# Altium schematic sheet hades_flight_controller_schematic.SchDoc (part 2 of 2)
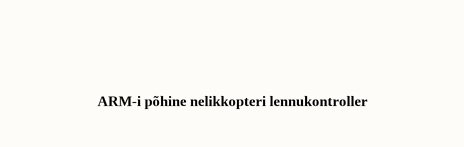
[diagram p4: hades_flight_controller_schematic.SchDoc, bottom right]

## Library data of the parts
C1-C3 C12 C15 = 1uF cap: Multilayer Ceramic Capacitors MLCC - SMD/SMT 0402 1.0uF 6.3volts *Derate Voltage/Temp; Manufacturer: Murata; Manufacturer Part Number: GRM155R70J105KA12D; Tolerance: 10%; Dielectric: X7R; Voltage Rating: 6.3V; Supplier 1: Farnell; Mount: Surface Mount; Case/Package: 0402; Case Code (Metric): 1005; Material: Ceramic; Case Code (Imperial): 0402; Weight: 0.000212oz; Min Operating Temperature: -55°C; Max Operating Temperature: 125°C; Capacitance: 1uF; Packaging: Tape and Reel; Termination: SMD/SMT; Voltage Rating (DC): 6.3V; Package Quantity: 10000; Length: 1mm; Width: 0.5mm; Height: 0.5mm; Thickness: 0.022inch; Depth: 0.5mm; Lead Free: Lead Free; RoHS Compliant: Yes; ComponentLink1URL: http://www.farnell.com/datasheets/2189111.pdf?src-supplier=Newark; ComponentLink1Description: http://www.farnell.com/datasheets/2189111.pdf?src-supplier=Newark; ComponentLink2URL: http://www.farnell.com/datasheets/2189111.pdf?src-supplier=Farnell; ComponentLink2Description: http://www.farnell.com/datasheets/2189111.pdf?src-supplier=Farnell; ComponentLink3URL: https://search.murata.co.jp/Ceramy/image/img/A01X/G101/ENG/GRM155R70J105KA12-01.pdf?src-supplier=Digi-Key; ComponentLink3Description: https://search.murata.co.jp/Ceramy/image/img/A01X/G101/ENG/GRM155R70J105KA12-01.pdf?src-supplier=Digi-Key; ComponentLink4URL: http://www.mouser.com/ds/2/281/c02e-2905.pdf?src-supplier=Mouser; ComponentLink4Description: http://www.mouser.com/ds/2/281/c02e-2905.pdf?src-supplier=Mouser; ComponentLink5URL: http://psearch.en.murata.com/capacitor/product/GRM155R70J105KA12%23.pdf?src-supplier=Avnet; ComponentLink5Description: http://psearch.en.murata.com/capacitor/product/GRM155R70J105KA12%23.pdf?src-supplier=Avnet; ComponentLink6URL: http://components.arrow.com/part/dataview/0323_06434986?src-supplier=Arrow+Europe; ComponentLink6Description: http://components.arrow.com/part/dataview/0323_06434986?src-supplier=Arrow+Europe; Supplier Part Number 1: 2346895
C4 C7-C10 C14 C16-C22 C24 C25 C35 C36 = 0.1uF cap: Cap, 0.1ΜF, 10V, 10%, X7R, 0603, Reel; Manufacturer: Multicomp; Manufacturer Part Number: MC0603B104K100CT; Capacitance: 100nF; Supplier 1: Farnell; Case Code (Metric): 1608; Case Code (Imperial): 0603; Min Operating Temperature: -55°C; Max Operating Temperature: 125°C; Voltage Rating: 10V; Dielectric: X7R; Packaging: Cut Tape; Tolerance: 10%; Voltage Rating (DC): 10V; REACH SVHC: No SVHC; ComponentLink1URL: http://www.farnell.com/datasheets/2117900.pdf?src-supplier=Element14; ComponentLink1Description: http://www.farnell.com/datasheets/2117900.pdf?src-supplier=Element14; ComponentLink2URL: http://www.farnell.com/datasheets/2117933.pdf?src-supplier=Farnell; ComponentLink2Description: http://www.farnell.com/datasheets/2117933.pdf?src-supplier=Farnell; ComponentLink3URL: http://www.farnell.com/datasheets/2117933.pdf?src-supplier=Element14; ComponentLink3Description: http://www.farnell.com/datasheets/2117933.pdf?src-supplier=Element14; Supplier Part Number 1: 1856307
C5 C6 = 22pF cap: 0402 22 pF 50 V ±5 % Tolerance C0G SMT Multilayer Ceramic Capacitor; Manufacturer: Murata; Manufacturer Part Number: GCM1555C1H220JA16D; Tolerance: 5%; Voltage Rating: 50V; Supplier 1: Farnell; Mount: Surface Mount; Case/Package: 0402; Case Code (Metric): 1005; Case Code (Imperial): 0402; Weight: 0.000212oz; Min Operating Temperature: -55°C; Max Operating Temperature: 125°C; Package Quantity: 1; Packaging: Tape and Reel; Capacitance: 22pF; Dielectric: C0G; Termination: SMD/SMT; Voltage Rating (DC): 50V; Length: 1mm; Width: 0.5mm; Height: 0.5mm; Thickness: 0.022inch; Depth: 0.5mm; Ratings: AEC-Q200; Lead Free: Lead Free; RoHS Compliant: Yes; ComponentLink1URL: http://www.farnell.com/datasheets/2189077.pdf?src-supplier=Farnell; ComponentLink1Description: http://www.farnell.com/datasheets/2189077.pdf?src-supplier=Farnell; ComponentLink2URL: http://www.farnell.com/datasheets/2189077.pdf?src-supplier=Element14; ComponentLink2Description: http://www.farnell.com/datasheets/2189077.pdf?src-supplier=Element14; ComponentLink3URL: http://search.murata.co.jp/Ceramy/image/img/A01X/partnumbering_e_02.pdf?src-supplier=Digi-Key; ComponentLink3Description: http://search.murata.co.jp/Ceramy/image/img/A01X/partnumbering_e_02.pdf?src-supplier=Digi-Key; ComponentLink4URL: http://www.mouser.com/ds/2/281/c03e-806517.pdf?src-supplier=Mouser; ComponentLink4Description: http://www.mouser.com/ds/2/281/c03e-806517.pdf?src-supplier=Mouser; ComponentLink5URL: http://psearch.en.murata.com/capacitor/product/GCM1555C1H220JA16%23.pdf?src-supplier=Avnet; ComponentLink5Description: http://psearch.en.murata.com/capacitor/product/GCM1555C1H220JA16%23.pdf?src-supplier=Avnet; ComponentLink6URL: http://components.arrow.com/part/dataview/0323_07199610?src-supplier=Arrow+Europe; ComponentLink6Description: http://components.arrow.com/part/dataview/0323_07199610?src-supplier=Arrow+Europe; Supplier Part Number 1: 2781410
C23 = 4.7uF cap: 0805 4.7 uF 50 V ±10% Tolerance X5R SMT Multilayer Ceramic Chip Capacitor; Manufacturer: Murata; Manufacturer Part Number: GRT21BR61H475KE13L; Voltage Rating: 50V; Supplier 1: Farnell; Stock 1: 51693; Mount: Surface Mount; Case/Package: 0805; Case Code (Metric): 2012; Case Code (Imperial): 0805; Min Operating Temperature: -55°C; Max Operating Temperature: 85°C; Packaging: Tape and Reel; Capacitance: 4.7uF; Tolerance: 10%; Dielectric: X5R; Voltage Rating (DC): 50V; Length: 0.079inch; Width: 0.049inch; Thickness: 0.057inch; Ratings: AEC-Q200; RoHS Compliant: Yes; ComponentLink1URL: http://www.farnell.com/datasheets/2165993.pdf?src-supplier=Farnell; ComponentLink1Description: http://www.farnell.com/datasheets/2165993.pdf?src-supplier=Farnell; ComponentLink2URL: http://www.farnell.com/datasheets/2165993.pdf?src-supplier=Element14; ComponentLink2Description: http://www.farnell.com/datasheets/2165993.pdf?src-supplier=Element14; ComponentLink3URL: http://search.murata.co.jp/Ceramy/image/img/A01X/G101/ENG/GRT21BR61H475KE13-01.pdf?src-supplier=Digi-Key; ComponentLink3Description: http://search.murata.co.jp/Ceramy/image/img/A01X/G101/ENG/GRT21BR61H475KE13-01.pdf?src-supplier=Digi-Key; Supplier Part Number 1: 2672194; Pricing 1: 5=0.38, 50=0.194, 250=0.174, 500=0.154, 1500=0.128, 3000=0.1, 15000=0.098 (EUR)
D1 = KP-1608QBC-D: LED Uni-Color Blue 468nm 2-Pin Chip LED T/R; Manufacturer: Kingbright; Lens Color: Clear; Viewing Angle: 120°; Lens Style: Diffused,Colorless,Circular,Rectangular; Number of LEDs: 1; Wavelength: 465nm; Luminous Intensity: 100mcd; Forward Voltage: 3.3V; Dominant Wavelength: 470nm; Forward Current: 20mA; Supplier 1: Farnell; Manufacturer Part Number: KP-1608QBC-D; Stock 1: 2000; Pricing 1: 2000=0.1 (EUR); Mount: Surface Mount; Case/Package: 1608; Number of Pins: 2; Color: Blue; Packaging: Tape and Reel; Series: KP; Length: 0.8mm; Width: 1.6mm; Height: 1.1mm; Radiation Hardening: No; REACH SVHC: No SVHC; RoHS Compliant: No; ComponentLink1URL: http://www.farnell.com/datasheets/2045913.pdf?src-supplier=Element14; ComponentLink1Description: http://www.farnell.com/datasheets/2045913.pdf?src-supplier=Element14; ComponentLink2URL: http://www.produktinfo.conrad.com/datenblaetter/1000000-1099999/001050379-da-01-en-SMD_CHIPLED_BL_0603_KP_1608QBC_D.pdf?src-supplier=Conrad; ComponentLink2Description: http://www.produktinfo.conrad.com/datenblaetter/1000000-1099999/001050379-da-01-en-SMD_CHIPLED_BL_0603_KP_1608QBC_D.pdf?src-supplier=Conrad; Supplier Part Number 1: 2449779
DS1 = MDOB048064AV-WI: Oled Graphic Display, Cob, 48 X 64PIXELS; Manufacturer: Midas; Supplier 1: Farnell; Manufacturer Part Number: MDOB048064AV-WI; Stock 1: 48; Supplier Part Number 1: 3154938; Pricing 1: 1=6.97, 5=6.06, 10=5.81, 50=4.98 (EUR)
G1 = LFXTAL055901: Crystal, 8MHZ, 18PF, 5MM X 3.2MM; Manufacturer: IQD; Supplier 1: Farnell; Manufacturer Part Number: LFXTAL055901; Stock 1: 2188; Pricing 1: 1=0.729, 50=0.517, 100=0.457, 250=0.43, 500=0.404, 1000=0.377, 5000=0.35 (EUR); Supplier Part Number 1: 2832062
J1-J4 = 292253-3 (motor): Headers & Wire Housings 3P R/A HDR ASSY; Manufacturer: TE Connectivity; Shape: Rectangular; Number of Positions: 3; Connector Type: Header,Pin; Wire/Cable Type: Discrete; Backwall/Post Interruptions: No (Without); Connector System: Wire-to-Board; Mating Alignment: Yes (With); PCB Mount Retention: With; PCB Mounting Orientation: Right Angle; Contact Current Rating: 4A; Contact Resistance: 20mR; Max Voltage Rating (AC): 125V; Current Rating: 2A; Gender: Male; Pitch: 2mm; PCB Thickness: 0.8mm; Tail Length: 3.2mm; Wire/Cable Gauge: 22AWG; Approvals: UL; Supplier 1: Farnell; Manufacturer Part Number: 292253-3; Mount: Through Hole; Contact Material: Brass; Contact Plating: Tin; Housing Color: Natural; Housing Material: Nylon; Color: Natural; Contact Shape: Round; Material: Nylon; Min Operating Temperature: -40°C; Max Operating Temperature: 105°C; Number of Rows: 1; Termination: Solder; Packaging: Bag; Package Quantity: 500; Number of Contacts: 3; Contact Retention: No (Without); Mating Retention: No (Without); PCB Mount Alignment: No (Without); Sealable: No (Without); Orientation: Right Angle; Series: AMP CT; Contact Type: Male Pin; Voltage Rating: 125V; Max Voltage Rating (DC): 125V; Contact Gender: Male; Length: 7.8mm; Width: 0.157inch; Height: 8.8mm; Contact Mating Length: 0.177inch; Depth: 8.8mm; Radiation Hardening: No; Flammability Rating: UL94 V-0; RoHS Compliant: Yes; ELV: Compliant; Lead Free: Lead Free; REACH SVHC: No SVHC; ComponentLink1URL: http://www.farnell.com/datasheets/1828722.pdf?src-supplier=Farnell; ComponentLink1Description: http://www.farnell.com/datasheets/1828722.pdf?src-supplier=Farnell; ComponentLink2URL: http://www.te.com/commerce/DocumentDelivery/DDEController?Action=showdoc&DocId=Data+Sheet%7F1-1773455-8_CT_CONNECTOR_SERIES_QRG%7F0909%7Fpdf%7FEnglish%7FENG_DS_1-1773455-8_CT_CONNECTOR_SERIES_QRG_0909.pdf&src-supplier=Avnet+Europe; ComponentLink2Description: http://www.te.com/commerce/DocumentDelivery/DDEController?Action=showdoc&DocId=Data+Sheet%7F1-1773455-8_CT_CONNECTOR_SERIES_QRG%7F0909%7Fpdf%7FEnglish%7FENG_DS_1-1773455-8_CT_CONNECTOR_SERIES_QRG_0909.pdf&src-supplier=Avnet+Europe; ComponentLink3URL: http://www.te.com/commerce/DocumentDelivery/DDEController?Action=showdoc&DocId=Data+Sheet%7F1-1773455-8_CT_CONNECTOR_SERIES_QRG%7F0909%7Fpdf%7FEnglish%7FENG_DS_1-1773455-8_CT_CONNECTOR_SERIES_QRG_0909.pdf&src-supplier=Avnet+Asia; ComponentLink3Description: http://www.te.com/commerce/DocumentDelivery/DDEController?Action=showdoc&DocId=Data+Sheet%7F1-1773455-8_CT_CONNECTOR_SERIES_QRG%7F0909%7Fpdf%7FEnglish%7FENG_DS_1-1773455-8_CT_CONNECTOR_SERIES_QRG_0909.pdf&src-supplier=Avnet+Asia; ComponentLink4URL: http://www.onlinecomponents.com/productFiles/mf-AMP/basics292253-3_0.pdf?src-supplier=Onlinecomponents.com; ComponentLink4Description: http://www.onlinecomponents.com/productFiles/mf-AMP/basics292253-3_0.pdf?src-supplier=Onlinecomponents.com; ComponentLink5URL: https://www.alliedelec.com/m/d/b828f7336fbcfaaba46c8aec8fa2474c.pdf?src-supplier=Allied+Electronics; ComponentLink5Description: https://www.alliedelec.com/m/d/b828f7336fbcfaaba46c8aec8fa2474c.pdf?src-supplier=Allied+Electronics; ComponentLink6URL: https://www.te.com/commerce/DocumentDelivery/DDEController?Action=srchrtrv&DocNm=292253&DocType=Customer+Drawing&DocLang=English&src-supplier=Digi-Key; ComponentLink6Description: https://www.te.com/commerce/DocumentDelivery/DDEController?Action=srchrtrv&DocNm=292253&DocType=Customer+Drawing&DocLang=English&src-supplier=Digi-Key; Supplier Part Number 1: 1675774
J5 = 292161-4 (balance): CONN HEADER 4POS VERT 2MM T/H; Manufacturer: TE Connectivity; Shape: Rectangular; Body Material: Nylon; Body Plating: Tin; Number of Positions: 4; Connector Type: Header,Pin; Mating Retention: No (Without); PCB Mount Retention: With; PCB Mounting Orientation: Vertical; Contact Resistance: 20mR; Max Voltage Rating (AC): 125V; Wire/Cable Type: Discrete; Connector System: Wire-to-Board; Contact Retention: Yes (With); Contact Current Rating: 4A; Contact Style: Straight; Gender: Male; Wire/Cable Gauge: 22AWG; Plating Thickness: 2um; Tail Length: 3.2mm; PCB Thickness: 0.8mm; Approvals: UL; Supplier 1: Farnell; Manufacturer Part Number: 292161-4; Stock 1: 3420; Pricing 1: 10=0.346, 100=0.282, 500=0.256, 1000=0.211, 2500=0.192, 5000=0.185 (EUR); Mount: Through Hole; Contact Plating: Tin; Contact Material: Brass; Housing Color: Natural; Housing Material: Nylon; Contact Shape: Round; Color: Natural; Material: Nylon; Min Operating Temperature: -40°C; Max Operating Temperature: 105°C; Number of Rows: 1; Packaging: Bag; Termination: Solder; Number of Contacts: 4; Package Quantity: 1000; Orientation: Straight; PCB Mount Alignment: No (Without); Sealable: No (Without); Series: AMP CT; Backwall/Post Interruptions: No (Without); Mating Alignment: No (Without); Strain Relief: No (Without); Voltage Rating: 125V; Contact Type: Male Pin; Current Rating: 4A; Contact Gender: Male; Voltage Rating (DC): 125V; Max Voltage Rating (DC): 125V; Voltage Rating (AC): 125V; Length: 9.8mm; Width: 3.6mm; Height: 0.267inch; Pitch: 2mm; Contact Mating Length: 0.177inch; Depth: 3.6mm; Lead Pitch: 2mm; Radiation Hardening: No; Flammability Rating: UL94 V-0; RoHS Compliant: Yes; ELV: Compliant; REACH SVHC: No SVHC; Lead Free: Lead Free; ComponentLink1URL: http://www.farnell.com/datasheets/1631402.pdf?src-supplier=Element14; ComponentLink1Description: http://www.farnell.com/datasheets/1631402.pdf?src-supplier=Element14; ComponentLink2URL: https://www.distrelec.biz/Web/Downloads/_t/ds/292161_x_eng_tds.pdf?mime=application%2Fpdf&src-supplier=Distrelec; ComponentLink2Description: https://www.distrelec.biz/Web/Downloads/_t/ds/292161_x_eng_tds.pdf?mime=application%2Fpdf&src-supplier=Distrelec; ComponentLink3URL: http://www.jameco.com/Jameco/Products/ProdDS/1931034.pdf?src-supplier=Jameco; ComponentLink3Description: http://www.jameco.com/Jameco/Products/ProdDS/1931034.pdf?src-supplier=Jameco; ComponentLink4URL: http://www.te.com/commerce/DocumentDelivery/DDEController?Action=showdoc&DocId=Data+Sheet%7F1-1773455-8_CT_CONNECTOR_SERIES_QRG%7F0909%7Fpdf%7FEnglish%7FENG_DS_1-1773455-8_CT_CONNECTOR_SERIES_QRG_0909.pdf&src-supplier=Avnet; ComponentLink4Description: http://www.te.com/commerce/DocumentDelivery/DDEController?Action=showdoc&DocId=Data+Sheet%7F1-1773455-8_CT_CONNECTOR_SERIES_QRG%7F0909%7Fpdf%7FEnglish%7FENG_DS_1-1773455-8_CT_CONNECTOR_SERIES_QRG_0909.pdf&src-supplier=Avnet; ComponentLink5URL: http://www.te.com/commerce/DocumentDelivery/DDEController?Action=showdoc&DocId=Customer+Drawing%7F292161%7FP%7Fpdf%7FEnglish%7FENG_CD_292161_P.pdf%7F292161-4&src-supplier=Future+Electronics; ComponentLink5Description: http://www.te.com/commerce/DocumentDelivery/DDEController?Action=showdoc&DocId=Customer+Drawing%7F292161%7FP%7Fpdf%7FEnglish%7FENG_CD_292161_P.pdf%7F292161-4&src-supplier=Future+Electronics; ComponentLink6URL: http://www.te.com/commerce/DocumentDelivery/DDEController?Action=showdoc&DocId=Data+Sheet%7F1-1773455-8_CT_CONNECTOR_SERIES_QRG%7F0909%7Fpdf%7FEnglish%7FENG_DS_1-1773455-8_CT_CONNECTOR_SERIES_QRG_0909.pdf&src-supplier=Avnet+Europe; ComponentLink6Description: http://www.te.com/commerce/DocumentDelivery/DDEController?Action=showdoc&DocId=Data+Sheet%7F1-1773455-8_CT_CONNECTOR_SERIES_QRG%7F0909%7Fpdf%7FEnglish%7FENG_DS_1-1773455-8_CT_CONNECTOR_SERIES_QRG_0909.pdf&src-supplier=Avnet+Europe; ComponentLink7URL: http://www.te.com/commerce/DocumentDelivery/DDEController?Action=srchrtrv&DocNm=292161&DocType=Customer+Drawing&DocLang=English&src-supplier=Digi-Key; ComponentLink7Description: http://www.te.com/commerce/DocumentDelivery/DDEController?Action=srchrtrv&DocNm=292161&DocType=Customer+Drawing&DocLang=English&src-supplier=Digi-Key; Supplier Part Number 1: 1282952
J6-J11 = 292253-3 (RC): Post Header Assembly, 3 Position, Horizontal, 2mm Pitch, DIP Standard Type; Manufacturer: TE Connectivity; Shape: Rectangular; Number of Positions: 3; Connector Type: Header,Pin; Wire/Cable Type: Discrete; Backwall/Post Interruptions: No (Without); Connector System: Wire-to-Board; Mating Alignment: Yes (With); PCB Mount Retention: With; PCB Mounting Orientation: Right Angle; Contact Current Rating: 4A; Contact Resistance: 20mR; Max Voltage Rating (AC): 125V; Current Rating: 2A; Gender: Male; PCB Thickness: 0.8mm; Tail Length: 3.2mm; Wire/Cable Gauge: 22AWG; Approvals: UL; Supplier 1: Farnell; Manufacturer Part Number: 292253-3; Mount: Through Hole; Contact Material: Brass; Contact Plating: Tin; Housing Color: Natural; Housing Material: Nylon; Color: Natural; Contact Shape: Round; Material: Nylon; Min Operating Temperature: -40°C; Max Operating Temperature: 105°C; Number of Rows: 1; Termination: Solder; Packaging: Bag; Package Quantity: 500; Number of Contacts: 3; Contact Retention: No (Without); Mating Retention: No (Without); PCB Mount Alignment: No (Without); Sealable: No (Without); Orientation: Right Angle; Series: AMP CT; Contact Type: Male Pin; Voltage Rating: 125V; Max Voltage Rating (DC): 125V; Contact Gender: Male; Length: 7.8mm; Width: 0.157inch; Height: 8.8mm; Pitch: 2mm; Contact Mating Length: 0.177inch; Depth: 8.8mm; Radiation Hardening: No; Flammability Rating: UL94 V-0; RoHS Compliant: Yes; ELV: Compliant; Lead Free: Lead Free; REACH SVHC: No SVHC; ComponentLink1URL: http://www.farnell.com/datasheets/1828722.pdf?src-supplier=Farnell; ComponentLink1Description: http://www.farnell.com/datasheets/1828722.pdf?src-supplier=Farnell; ComponentLink2URL: http://www.te.com/commerce/DocumentDelivery/DDEController?Action=showdoc&DocId=Data+Sheet%7F1-1773455-8_CT_CONNECTOR_SERIES_QRG%7F0909%7Fpdf%7FEnglish%7FENG_DS_1-1773455-8_CT_CONNECTOR_SERIES_QRG_0909.pdf&src-supplier=Avnet+Europe; ComponentLink2Description: http://www.te.com/commerce/DocumentDelivery/DDEController?Action=showdoc&DocId=Data+Sheet%7F1-1773455-8_CT_CONNECTOR_SERIES_QRG%7F0909%7Fpdf%7FEnglish%7FENG_DS_1-1773455-8_CT_CONNECTOR_SERIES_QRG_0909.pdf&src-supplier=Avnet+Europe; ComponentLink3URL: http://www.te.com/commerce/DocumentDelivery/DDEController?Action=showdoc&DocId=Data+Sheet%7F1-1773455-8_CT_CONNECTOR_SERIES_QRG%7F0909%7Fpdf%7FEnglish%7FENG_DS_1-1773455-8_CT_CONNECTOR_SERIES_QRG_0909.pdf&src-supplier=Avnet+Asia; ComponentLink3Description: http://www.te.com/commerce/DocumentDelivery/DDEController?Action=showdoc&DocId=Data+Sheet%7F1-1773455-8_CT_CONNECTOR_SERIES_QRG%7F0909%7Fpdf%7FEnglish%7FENG_DS_1-1773455-8_CT_CONNECTOR_SERIES_QRG_0909.pdf&src-supplier=Avnet+Asia; ComponentLink4URL: http://www.onlinecomponents.com/productFiles/mf-AMP/basics292253-3_0.pdf?src-supplier=Onlinecomponents.com; ComponentLink4Description: http://www.onlinecomponents.com/productFiles/mf-AMP/basics292253-3_0.pdf?src-supplier=Onlinecomponents.com; ComponentLink5URL: https://www.alliedelec.com/m/d/b828f7336fbcfaaba46c8aec8fa2474c.pdf?src-supplier=Allied+Electronics; ComponentLink5Description: https://www.alliedelec.com/m/d/b828f7336fbcfaaba46c8aec8fa2474c.pdf?src-supplier=Allied+Electronics; ComponentLink6URL: https://www.te.com/commerce/DocumentDelivery/DDEController?Action=srchrtrv&DocNm=292253&DocType=Customer+Drawing&DocLang=English&src-supplier=Digi-Key; ComponentLink6Description: https://www.te.com/commerce/DocumentDelivery/DDEController?Action=srchrtrv&DocNm=292253&DocType=Customer+Drawing&DocLang=English&src-supplier=Digi-Key; Supplier Part Number 1: 1675774
J12 = 292161-4 (led driver): CONN HEADER 4POS VERT 2MM T/H; Manufacturer: TE Connectivity; Shape: Rectangular; Body Material: Nylon; Body Plating: Tin; Number of Positions: 4; Connector Type: Header,Pin; Mating Retention: No (Without); PCB Mount Retention: With; PCB Mounting Orientation: Vertical; Contact Resistance: 20mR; Max Voltage Rating (AC): 125V; Wire/Cable Type: Discrete; Connector System: Wire-to-Board; Contact Retention: Yes (With); Contact Current Rating: 4A; Contact Style: Straight; Gender: Male; Wire/Cable Gauge: 22AWG; Plating Thickness: 2um; Tail Length: 3.2mm; PCB Thickness: 0.8mm; Approvals: UL; Supplier 1: Farnell; Manufacturer Part Number: 292161-4; Stock 1: 3420; Pricing 1: 10=0.346, 100=0.282, 500=0.256, 1000=0.211, 2500=0.192, 5000=0.185 (EUR); Mount: Through Hole; Contact Plating: Tin; Contact Material: Brass; Housing Color: Natural; Housing Material: Nylon; Contact Shape: Round; Color: Natural; Material: Nylon; Min Operating Temperature: -40°C; Max Operating Temperature: 105°C; Number of Rows: 1; Packaging: Bag; Termination: Solder; Number of Contacts: 4; Package Quantity: 1000; Orientation: Straight; PCB Mount Alignment: No (Without); Sealable: No (Without); Series: AMP CT; Backwall/Post Interruptions: No (Without); Mating Alignment: No (Without); Strain Relief: No (Without); Voltage Rating: 125V; Contact Type: Male Pin; Current Rating: 4A; Contact Gender: Male; Voltage Rating (DC): 125V; Max Voltage Rating (DC): 125V; Voltage Rating (AC): 125V; Length: 9.8mm; Width: 3.6mm; Height: 0.267inch; Pitch: 2mm; Contact Mating Length: 0.177inch; Depth: 3.6mm; Lead Pitch: 2mm; Radiation Hardening: No; Flammability Rating: UL94 V-0; RoHS Compliant: Yes; ELV: Compliant; REACH SVHC: No SVHC; Lead Free: Lead Free; ComponentLink1URL: http://www.farnell.com/datasheets/1631402.pdf?src-supplier=Element14; ComponentLink1Description: http://www.farnell.com/datasheets/1631402.pdf?src-supplier=Element14; ComponentLink2URL: https://www.distrelec.biz/Web/Downloads/_t/ds/292161_x_eng_tds.pdf?mime=application%2Fpdf&src-supplier=Distrelec; ComponentLink2Description: https://www.distrelec.biz/Web/Downloads/_t/ds/292161_x_eng_tds.pdf?mime=application%2Fpdf&src-supplier=Distrelec; ComponentLink3URL: http://www.jameco.com/Jameco/Products/ProdDS/1931034.pdf?src-supplier=Jameco; ComponentLink3Description: http://www.jameco.com/Jameco/Products/ProdDS/1931034.pdf?src-supplier=Jameco; ComponentLink4URL: http://www.te.com/commerce/DocumentDelivery/DDEController?Action=showdoc&DocId=Data+Sheet%7F1-1773455-8_CT_CONNECTOR_SERIES_QRG%7F0909%7Fpdf%7FEnglish%7FENG_DS_1-1773455-8_CT_CONNECTOR_SERIES_QRG_0909.pdf&src-supplier=Avnet; ComponentLink4Description: http://www.te.com/commerce/DocumentDelivery/DDEController?Action=showdoc&DocId=Data+Sheet%7F1-1773455-8_CT_CONNECTOR_SERIES_QRG%7F0909%7Fpdf%7FEnglish%7FENG_DS_1-1773455-8_CT_CONNECTOR_SERIES_QRG_0909.pdf&src-supplier=Avnet; ComponentLink5URL: http://www.te.com/commerce/DocumentDelivery/DDEController?Action=showdoc&DocId=Customer+Drawing%7F292161%7FP%7Fpdf%7FEnglish%7FENG_CD_292161_P.pdf%7F292161-4&src-supplier=Future+Electronics; ComponentLink5Description: http://www.te.com/commerce/DocumentDelivery/DDEController?Action=showdoc&DocId=Customer+Drawing%7F292161%7FP%7Fpdf%7FEnglish%7FENG_CD_292161_P.pdf%7F292161-4&src-supplier=Future+Electronics; ComponentLink6URL: http://www.te.com/commerce/DocumentDelivery/DDEController?Action=showdoc&DocId=Data+Sheet%7F1-1773455-8_CT_CONNECTOR_SERIES_QRG%7F0909%7Fpdf%7FEnglish%7FENG_DS_1-1773455-8_CT_CONNECTOR_SERIES_QRG_0909.pdf&src-supplier=Avnet+Europe; ComponentLink6Description: http://www.te.com/commerce/DocumentDelivery/DDEController?Action=showdoc&DocId=Data+Sheet%7F1-1773455-8_CT_CONNECTOR_SERIES_QRG%7F0909%7Fpdf%7FEnglish%7FENG_DS_1-1773455-8_CT_CONNECTOR_SERIES_QRG_0909.pdf&src-supplier=Avnet+Europe; ComponentLink7URL: http://www.te.com/commerce/DocumentDelivery/DDEController?Action=srchrtrv&DocNm=292161&DocType=Customer+Drawing&DocLang=English&src-supplier=Digi-Key; ComponentLink7Description: http://www.te.com/commerce/DocumentDelivery/DDEController?Action=srchrtrv&DocNm=292161&DocType=Customer+Drawing&DocLang=English&src-supplier=Digi-Key; Supplier Part Number 1: 1282952
J13 = 292161-4: CONN HEADER 4POS VERT 2MM T/H; Manufacturer: TE Connectivity; Shape: Rectangular; Body Material: Nylon; Body Plating: Tin; Number of Positions: 4; Connector Type: Header,Pin; Mating Retention: No (Without); PCB Mount Retention: With; PCB Mounting Orientation: Vertical; Contact Resistance: 20mR; Max Voltage Rating (AC): 125V; Wire/Cable Type: Discrete; Connector System: Wire-to-Board; Contact Retention: Yes (With); Contact Current Rating: 4A; Contact Style: Straight; Gender: Male; Wire/Cable Gauge: 22AWG; Plating Thickness: 2um; Tail Length: 3.2mm; PCB Thickness: 0.8mm; Approvals: UL; Supplier 1: Farnell; Manufacturer Part Number: 292161-4; Mount: Through Hole; Contact Plating: Tin; Contact Material: Brass; Housing Color: Natural; Housing Material: Nylon; Contact Shape: Round; Color: Natural; Material: Nylon; Min Operating Temperature: -40°C; Max Operating Temperature: 105°C; Number of Rows: 1; Packaging: Bag; Termination: Solder; Number of Contacts: 4; Package Quantity: 1000; Orientation: Straight; PCB Mount Alignment: No (Without); Sealable: No (Without); Series: AMP CT; Backwall/Post Interruptions: No (Without); Mating Alignment: No (Without); Strain Relief: No (Without); Voltage Rating: 125V; Contact Type: Male Pin; Current Rating: 4A; Contact Gender: Male; Voltage Rating (DC): 125V; Max Voltage Rating (DC): 125V; Voltage Rating (AC): 125V; Length: 9.8mm; Width: 3.6mm; Height: 0.267inch; Pitch: 2mm; Contact Mating Length: 0.177inch; Depth: 3.6mm; Lead Pitch: 2mm; Radiation Hardening: No; Flammability Rating: UL94 V-0; RoHS Compliant: Yes; ELV: Compliant; REACH SVHC: No SVHC; Lead Free: Lead Free; ComponentLink1URL: http://www.farnell.com/datasheets/1631402.pdf?src-supplier=Element14; ComponentLink1Description: http://www.farnell.com/datasheets/1631402.pdf?src-supplier=Element14; ComponentLink2URL: https://www.distrelec.biz/Web/Downloads/_t/ds/292161_x_eng_tds.pdf?mime=application%2Fpdf&src-supplier=Distrelec; ComponentLink2Description: https://www.distrelec.biz/Web/Downloads/_t/ds/292161_x_eng_tds.pdf?mime=application%2Fpdf&src-supplier=Distrelec; ComponentLink3URL: http://www.jameco.com/Jameco/Products/ProdDS/1931034.pdf?src-supplier=Jameco; ComponentLink3Description: http://www.jameco.com/Jameco/Products/ProdDS/1931034.pdf?src-supplier=Jameco; ComponentLink4URL: http://www.te.com/commerce/DocumentDelivery/DDEController?Action=showdoc&DocId=Data+Sheet%7F1-1773455-8_CT_CONNECTOR_SERIES_QRG%7F0909%7Fpdf%7FEnglish%7FENG_DS_1-1773455-8_CT_CONNECTOR_SERIES_QRG_0909.pdf&src-supplier=Avnet; ComponentLink4Description: http://www.te.com/commerce/DocumentDelivery/DDEController?Action=showdoc&DocId=Data+Sheet%7F1-1773455-8_CT_CONNECTOR_SERIES_QRG%7F0909%7Fpdf%7FEnglish%7FENG_DS_1-1773455-8_CT_CONNECTOR_SERIES_QRG_0909.pdf&src-supplier=Avnet; ComponentLink5URL: http://www.te.com/commerce/DocumentDelivery/DDEController?Action=showdoc&DocId=Customer+Drawing%7F292161%7FP%7Fpdf%7FEnglish%7FENG_CD_292161_P.pdf%7F292161-4&src-supplier=Future+Electronics; ComponentLink5Description: http://www.te.com/commerce/DocumentDelivery/DDEController?Action=showdoc&DocId=Customer+Drawing%7F292161%7FP%7Fpdf%7FEnglish%7FENG_CD_292161_P.pdf%7F292161-4&src-supplier=Future+Electronics; ComponentLink6URL: http://www.te.com/commerce/DocumentDelivery/DDEController?Action=showdoc&DocId=Data+Sheet%7F1-1773455-8_CT_CONNECTOR_SERIES_QRG%7F0909%7Fpdf%7FEnglish%7FENG_DS_1-1773455-8_CT_CONNECTOR_SERIES_QRG_0909.pdf&src-supplier=Avnet+Europe; ComponentLink6Description: http://www.te.com/commerce/DocumentDelivery/DDEController?Action=showdoc&DocId=Data+Sheet%7F1-1773455-8_CT_CONNECTOR_SERIES_QRG%7F0909%7Fpdf%7FEnglish%7FENG_DS_1-1773455-8_CT_CONNECTOR_SERIES_QRG_0909.pdf&src-supplier=Avnet+Europe; ComponentLink7URL: http://www.te.com/commerce/DocumentDelivery/DDEController?Action=srchrtrv&DocNm=292161&DocType=Customer+Drawing&DocLang=English&src-supplier=Digi-Key; ComponentLink7Description: http://www.te.com/commerce/DocumentDelivery/DDEController?Action=srchrtrv&DocNm=292161&DocType=Customer+Drawing&DocLang=English&src-supplier=Digi-Key; Supplier Part Number 1: 1206005
OA1-OA3 = MIC920YC5-TR: MIC920 Series 80 MHz 3000 v/us 9 V High-Speed Operational Amplifier - SOT-23-5; Manufacturer: Microchip; -3db Bandwidth: 115MHz; Slew Rate: 3000V/µs; Number of Channels: 1; Max Supply Voltage: 9V; Gain Bandwidth Product: 80MHz; Input Bias Current: 230nA; Input Offset Voltage (Vos): 300uV; Operating Supply Current: 550uA; Output Current per Channel: 65mA; Amplifier Type: GENERAL PURPOSE; Supplier 1: Farnell; Manufacturer Part Number: MIC920YC5-TR; Stock 1: 1311; Mount: Surface Mount; Number of Pins: 5; Min Operating Temperature: -40°C; Max Operating Temperature: 85°C; Package Quantity: 3000; Packaging: Tape and Reel; Number of Circuits: 1; Series: -; Input Offset Voltage-Max: 300uV; Slew Rate-Nom: 3000V/µs; Lead Free: Lead Free; RoHS Compliant: Yes; ComponentLink1URL: http://www.micrel.com/_PDF/mic920.pdf?src-supplier=Future+Electronics; ComponentLink1Description: http://www.micrel.com/_PDF/mic920.pdf?src-supplier=Future+Electronics; Supplier Part Number 1: 2920854; Pricing 1: 1=0.458, 25=0.397, 100=0.382, 3000=0.367 (EUR)
R1 R2 R15 R16 = 2.2kOhm resistor: TE CONNECTIVITY - CRGCQ0603J2K2 - SMD Chip Resistor, 0603 [1608 Metric], 2.2 kohm, CRGCQ Series, 75 V, Thick Film, 100 mW - SMD Chip Resistor, 0603 [1608 Metric], 2.2 kohm, CRGCQ Series, 75 V, Thick Film, 100 mW; Supplier 1: Farnell; Manufacturer: TE Connectivity; Manufacturer Part Number: CRGCQ0603J2K2; RoHS Compliant: Yes; ComponentLink1URL: https://4donline.ihs.com/images/VipMasterIC/IC/TYEL/TYEL-S-A0004929575/TYEL-S-A0004929575-1.pdf?hkey=52A5661711E402568146F3353EA87419&src-supplier=Element14; ComponentLink1Description: https://4donline.ihs.com/images/VipMasterIC/IC/TYEL/TYEL-S-A0004929575/TYEL-S-A0004929575-1.pdf?hkey=52A5661711E402568146F3353EA87419&src-supplier=Element14; ComponentLink2URL: https://4donline.ihs.com/images/VipMasterIC/IC/TYEL/TYEL-S-A0004929575/TYEL-S-A0004929575-1.pdf?hkey=52A5661711E402568146F3353EA87419&src-supplier=Newark; ComponentLink2Description: https://4donline.ihs.com/images/VipMasterIC/IC/TYEL/TYEL-S-A0004929575/TYEL-S-A0004929575-1.pdf?hkey=52A5661711E402568146F3353EA87419&src-supplier=Newark; ComponentLink3URL: https://www.te.com/commerce/DocumentDelivery/DDEController?Action=srchrtrv&amp;DocNm=1773204-3&amp;DocType=DS&amp;DocLang=English&src-supplier=Digi-Key; ComponentLink3Description: https://www.te.com/commerce/DocumentDelivery/DDEController?Action=srchrtrv&amp;DocNm=1773204-3&amp;DocType=DS&amp;DocLang=English&src-supplier=Digi-Key; Supplier Part Number 1: 2861866
R3-R6 = 1kOhm resistor: ROHM - ESR03EZPF1001 - SMD Chip Resistor, Anti-Surge, 0603 [1608 Metric], 1 kohm, ESR Series, 150 V, Thick Film, 250 mW; Resistance: 1kR; Power Rating: 250mW; Tolerance: 1%; Temperature Coefficient: 100ppm/°C; Supplier 1: Farnell; Manufacturer: Rohm; Manufacturer Part Number: ESR03EZPF1001; Case/Package: 0603; Case Code (Metric): 1608; Case Code (Imperial): 0603; Size Code: 0603; Min Operating Temperature: -55°C; Max Operating Temperature: 155°C; Package Quantity: 1; Packaging: Tape and Reel; Resistor Type: Thick Film; Number of Terminations: 2; Max Power Dissipation: 250mW; Features: Automotive AEC-Q200; Series: ESR; Length: 0.063inch; Width: 0.031inch; Height: 0.022inch; Lead Free: Lead Free; RoHS Compliant: Yes; ComponentLink1URL: https://www.rohm.com/datasheet/ESR01MZPF/esr-e?src-supplier=Digi-Key; ComponentLink1Description: https://www.rohm.com/datasheet/ESR01MZPF/esr-e?src-supplier=Digi-Key; Supplier Part Number 1: 2887143
R7 R8 R13 R18 = 100kOhm resistor: Res General Purpose Thick Film 0402 100k Ohm 1% 1/16W ±100ppm/°C Molded Paper T/R; Manufacturer: TE Connectivity; Manufacturer Part Number: CRGCQ0402F100K; Resistance: 100kR; Max Power Dissipation: 63mW; Supplier 1: Farnell; Case/Package: 0402; Case Code (Imperial): 0402; Case Code (Metric): 1005; Min Operating Temperature: -55°C; Max Operating Temperature: 155°C; Resistor Type: Thick Film; Features: Moisture Resistant,Automotive AEC-Q200; Packaging: Tape and Reel; Tolerance: 1%; Temperature Coefficient: 100ppm/°C; Number of Terminations: 2; RoHS Compliant: Yes; ComponentLink1URL: https://4donline.ihs.com/images/VipMasterIC/IC/TYEL/TYEL-S-A0004929575/TYEL-S-A0004929575-1.pdf?hkey=52A5661711E402568146F3353EA87419&src-supplier=Farnell; ComponentLink1Description: https://4donline.ihs.com/images/VipMasterIC/IC/TYEL/TYEL-S-A0004929575/TYEL-S-A0004929575-1.pdf?hkey=52A5661711E402568146F3353EA87419&src-supplier=Farnell; ComponentLink2URL: https://4donline.ihs.com/images/VipMasterIC/IC/TYEL/TYEL-S-A0004929575/TYEL-S-A0004929575-1.pdf?hkey=52A5661711E402568146F3353EA87419&src-supplier=Element14; ComponentLink2Description: https://4donline.ihs.com/images/VipMasterIC/IC/TYEL/TYEL-S-A0004929575/TYEL-S-A0004929575-1.pdf?hkey=52A5661711E402568146F3353EA87419&src-supplier=Element14; ComponentLink3URL: https://4donline.ihs.com/images/VipMasterIC/IC/TYEL/TYEL-S-A0004929575/TYEL-S-A0004929575-1.pdf?hkey=52A5661711E402568146F3353EA87419&src-supplier=Newark; ComponentLink3Description: https://4donline.ihs.com/images/VipMasterIC/IC/TYEL/TYEL-S-A0004929575/TYEL-S-A0004929575-1.pdf?hkey=52A5661711E402568146F3353EA87419&src-supplier=Newark; ComponentLink4URL: https://www.te.com/commerce/DocumentDelivery/DDEController?Action=srchrtrv&amp;DocNm=1773204-3&amp;DocType=DS&amp;DocLang=English&src-supplier=Digi-Key; ComponentLink4Description: https://www.te.com/commerce/DocumentDelivery/DDEController?Action=srchrtrv&amp;DocNm=1773204-3&amp;DocType=DS&amp;DocLang=English&src-supplier=Digi-Key; Supplier Part Number 1: 3495222
R12 R14 R17 R24 R25 = 200kOhm resistor: Res Thin Film 0603 200K Ohm 0.1% 1/10W ±25ppm/°C Molded SMD SMD Punched Carrier T/R; Manufacturer: Panasonic; Manufacturer Part Number: ERA-3AEB204V; Voltage Rating (DC): 75V; Resistance: 200kR; Power Rating: 100mW; Supplier 1: Farnell; Mount: Surface Mount; Case/Package: 0603; Number of Pins: 2; Contact Plating: Tin; Case Code (Metric): 1608; Case Code (Imperial): 0603; Size Code: 0603; Min Operating Temperature: -55°C; Max Operating Temperature: 155°C; Package Quantity: 5000; Packaging: Tape and Reel; Series: ERA-3A; Tolerance: 0.1%; Voltage Rating: 75V; Resistor Type: Thin Film; Termination: SMD/SMT; Temperature Coefficient: 25ppm/°C; Max Power Dissipation: 100mW; Resistance Tolerance: 0.1%; Technology: THIN FILM; Number of Terminations: 2; Features: Automotive AEC-Q200; Construction: Rectangular; Length: 1.6mm; Width: 0.8mm; Height: 0.45mm; Depth: 0.8mm; Radiation Hardening: No; REACH SVHC: No SVHC; Lead Free: Lead Free; RoHS Compliant: Yes; Military Standard: Not; ComponentLink1URL: https://www.distrelec.biz/Web/Downloads/_t/ds/ERA_eng_tds.pdf?mime=application%2Fpdf&src-supplier=Distrelec; ComponentLink1Description: https://www.distrelec.biz/Web/Downloads/_t/ds/ERA_eng_tds.pdf?mime=application%2Fpdf&src-supplier=Distrelec; ComponentLink2URL: http://www.farnell.com/datasheets/485442.pdf?src-supplier=Element14; ComponentLink2Description: http://www.farnell.com/datasheets/485442.pdf?src-supplier=Element14; ComponentLink3URL: http://www.farnell.com/datasheets/2059650.pdf?src-supplier=Farnell; ComponentLink3Description: http://www.farnell.com/datasheets/2059650.pdf?src-supplier=Farnell; ComponentLink4URL: http://www.farnell.com/datasheets/485442.pdf?src-supplier=Farnell; ComponentLink4Description: http://www.farnell.com/datasheets/485442.pdf?src-supplier=Farnell; ComponentLink5URL: http://www.farnell.com/datasheets/39837.pdf?src-supplier=Element14; ComponentLink5Description: http://www.farnell.com/datasheets/39837.pdf?src-supplier=Element14; ComponentLink6URL: https://www.alliedelec.com/m/d/b6b0537e86f421aa7f5975bb1d8f429a.pdf?src-supplier=Allied+Electronics; ComponentLink6Description: https://www.alliedelec.com/m/d/b6b0537e86f421aa7f5975bb1d8f429a.pdf?src-supplier=Allied+Electronics; ComponentLink7URL: http://industrial.panasonic.com/www-data/pdf/AOA0000/AOA0000CE26.pdf?src-supplier=Avnet; ComponentLink7Description: http://industrial.panasonic.com/www-data/pdf/AOA0000/AOA0000CE26.pdf?src-supplier=Avnet; ComponentLink8URL: http://www.produktinfo.conrad.com/datenblaetter/450000-474999/451764-da-01-en-WIDERSTAND_0603_ERA.pdf?src-supplier=Conrad; ComponentLink8Description: http://www.produktinfo.conrad.com/datenblaetter/450000-474999/451764-da-01-en-WIDERSTAND_0603_ERA.pdf?src-supplier=Conrad; Supplier Part Number 1: 3495762
R23 = 50Ohm resistor: Res, 50R, 1%, 0.063W, 0402 Rohs Compliant: Yes; Manufacturer: KOA Speer; Manufacturer Part Number: RN73R1ETTP50R0F50; Supplier 1: Farnell; ComponentLink1URL: https://datasheet.octopart.com/RN73R1ETTP50R0F50-KOA-Speer-datasheet-149653819.pdf?src-supplier=Farnell; ComponentLink1Description: https://datasheet.octopart.com/RN73R1ETTP50R0F50-KOA-Speer-datasheet-149653819.pdf?src-supplier=Farnell; Supplier Part Number 1: 3544456
S1-S4 = EVQ-Q2D03W: SWITCH, SMD, 6.5X6X3.1MM, 0.5N; Manufacturer: Panasonic; Mechanical Life: 2000000Cycles; Actuator Color: White; Current Rating: 20mA; Voltage Rating (DC): 15V; Voltage Rating (AC): 250V; Throw Configuration: SPST; Contact Resistance: 100mR; Illumination Type: Non-Illuminated,Illuminated; Switch Travel: 0.2mm; Switch Function: Off-Mom; Actuator Type: Standard; Actuator Length: 1.3mm; Body Depth: 6mm; Supplier 1: Farnell; Manufacturer Part Number: EVQ-Q2D03W; Stock 1: 0; Pricing 1: 2000=0.191 (EUR); Mount: Surface Mount; Case/Package: SMD/SMT; Color: White; Contact Plating: Silver,Gold; Min Operating Temperature: -40°C; Max Operating Temperature: 85°C; Package Quantity: 1; Operating Force: 0.5N; Packaging: Tape and Reel; Max Current Rating: 20mA; Max Voltage Rating (DC): 15V; Contact Current Rating: 20mA; Termination: SMD/SMT; Electrical Life: 2000000Cycles; Orientation: Straight; Max Voltage Rating (AC): 250V; Series: EVQQ2; Length: 6mm; Height: 3.1mm; Depth: 6.6mm; Thickness: 1.8mm; Size: 1.8mm; Radiation Hardening: No; REACH SVHC: Unknown; Lead Free: Lead Free; ComponentLink1URL: http://www.farnell.com/datasheets/578646.pdf?src-supplier=Element14; ComponentLink1Description: http://www.farnell.com/datasheets/578646.pdf?src-supplier=Element14; ComponentLink2URL: http://www.farnell.com/datasheets/2244072.pdf?src-supplier=Farnell; ComponentLink2Description: http://www.farnell.com/datasheets/2244072.pdf?src-supplier=Farnell; ComponentLink3URL: http://uk.rs-online.com/webdocs/10ad/0900766b810ad242.pdf?src-supplier=RSComponents; ComponentLink3Description: http://uk.rs-online.com/webdocs/10ad/0900766b810ad242.pdf?src-supplier=RSComponents; ComponentLink4URL: http://industrial.panasonic.com/www-data/pdf/ATK0000/ATK0000CE28.pdf?src-supplier=Avnet; ComponentLink4Description: http://industrial.panasonic.com/www-data/pdf/ATK0000/ATK0000CE28.pdf?src-supplier=Avnet; ComponentLink5URL: https://industrial.panasonic.com/cdbs/www-data/pdf/ATK0000/ATK0000CE28.pdf?src-supplier=Digi-Key; ComponentLink5Description: https://industrial.panasonic.com/cdbs/www-data/pdf/ATK0000/ATK0000CE28.pdf?src-supplier=Digi-Key; ComponentLink6URL: https://industrial.panasonic.com/ac/cdn/e/control/switch/light-touch/catalog/sw_lt_eng_6s_th.pdf?src-supplier=Digi-Key; ComponentLink6Description: https://industrial.panasonic.com/ac/cdn/e/control/switch/light-touch/catalog/sw_lt_eng_6s_th.pdf?src-supplier=Digi-Key; Supplier Part Number 1: 2459497
U1 = 24C02C/SN: MICROCHIP - 24C02C/SN - SERIAL EEPROM, 2KBIT, 400KHZ, SOIC-8; Access Time: 900ns; Density: 2Kb; Interface: I2C,Serial,2-Wire; Operating Supply Voltage: 5V; Max Supply Voltage: 5.5V; Min Supply Voltage: 4.5V; Nominal Supply Current: 3mA; Organization: 256X8; Write Protection: YES; Write Cycle Time-Max (tWC): 1.5ms; Number of Words: 256; Supplier 1: Farnell; Manufacturer: Microchip; Manufacturer Part Number: 24C02C/SN; Stock 1: 1100; Pricing 1: 1=0.423, 25=0.415, 100=0.406 (EUR); Mount: Surface Mount; Case/Package: SOIC; Number of Pins: 8; Min Operating Temperature: 0°C; Max Operating Temperature: 70°C; Max Frequency: 400kHz; Frequency: 400kHz; Packaging: Rail/Tube; Package Quantity: 100; Memory Type: EEPROM; Memory Size: 2Kb; Access Time-Max: 900ns; Supply Current: 3mA; Programming Voltage: 5.5V; Supply Voltage-Nom: 5.5V; Length: 4.9mm; Width: 3.9mm; Height: 1.5mm; Radiation Hardening: No; Lead Free: Lead Free; RoHS Compliant: Yes; REACH SVHC: No SVHC; ComponentLink1URL: http://www.farnell.com/datasheets/1688094.pdf?src-supplier=Element14; ComponentLink1Description: http://www.farnell.com/datasheets/1688094.pdf?src-supplier=Element14; ComponentLink2URL: http://ww1.microchip.com/downloads/en/DeviceDoc/21202d.pdf?src-supplier=Mouser; ComponentLink2Description: http://ww1.microchip.com/downloads/en/DeviceDoc/21202d.pdf?src-supplier=Mouser; ComponentLink3URL: https://www.alliedelec.com/m/d/de95da595ed0857ba5ed453637810f1b.pdf?src-supplier=Allied+Electronics; ComponentLink3Description: https://www.alliedelec.com/m/d/de95da595ed0857ba5ed453637810f1b.pdf?src-supplier=Allied+Electronics; Supplier Part Number 1: 1607552
U2 = LPC5512JBD100E: MCU 32-Bit LPC5512 ARM Cortex-M33 RISC 64KB Flash 1.8V to 3.6V 100-Pin HLQFP Tray; Manufacturer: NXP Semiconductors; Supplier 1: Farnell; Manufacturer Part Number: LPC5512JBD100E; Stock 1: 70; RoHS Compliant: Yes; Supplier Part Number 1: 3385148; Pricing 1: 1=6.98, 10=4.28, 25=4.19, 50=4.11 (EUR)
U3 U6 = NVT2006BS,118: NVT2006 Series Bidirectional Open Drain Voltage Level Translator - HVQFN-16; Manufacturer: NXP Semiconductors; Number of Channels: 6; Propagation Delay: 1.5ns; Max Supply Voltage: 5.5V; Min Supply Voltage: 1.8V; Operating Frequency-Max: 33MHz; Supplier 1: Farnell; Manufacturer Part Number: NVT2006BS,118; Stock 1: 6000; Number of Pins: 16; Min Operating Temperature: -40°C; Max Operating Temperature: 85°C; Packaging: Tape and Reel; Package Quantity: 6000; Logic Function: Translator; Number of Bits: 6; Output Type: Voltage; Series: -; Radiation Hardening: No; Lead Free: Lead Free; RoHS Compliant: Yes; ComponentLink1URL: http://www.nxp.com/documents/data_sheet/NVT2003_04_06.pdf?src-supplier=Digi-Key; ComponentLink1Description: http://www.nxp.com/documents/data_sheet/NVT2003_04_06.pdf?src-supplier=Digi-Key; ComponentLink2URL: https://www.nxp.com/docs/en/data-sheet/NVT2003_04_06.pdf?src-supplier=Digi-Key; ComponentLink2Description: https://www.nxp.com/docs/en/data-sheet/NVT2003_04_06.pdf?src-supplier=Digi-Key; ComponentLink3URL: http://ics.nxp.com/interface/to/documents/data_sheet/NVT2003_04_06.pdf?src-supplier=Avnet; ComponentLink3Description: http://ics.nxp.com/interface/to/documents/data_sheet/NVT2003_04_06.pdf?src-supplier=Avnet; Supplier Part Number 1: 2890115; Pricing 1: 1=0.47, 10=0.35, 100=0.336, 500=0.323, 1000=0.309, 2500=0.296, 5000=0.282 (EUR)
U4 = ICM-20948: IMU ACCEL/GYRO/COMPI2C/SPI 24QFN; Manufacturer: TDK InvenSense; Sensor Type: Accelerometer,Gyroscope,Magnetometer; Output Type: SPI,I2C; Supplier 1: Farnell; Manufacturer Part Number: ICM-20948; Stock 1: 0; Pricing 1: 1=6.72, 10=4.51, 25=4.42, 50=4.33 (EUR); Mount: Surface Mount; Case/Package: QFN; Min Operating Temperature: -40°C; Max Operating Temperature: 85°C; Packaging: Tape and Reel; RoHS Compliant: Yes; ComponentLink1URL: https://www.invensense.com/wp-content/uploads/2016/06/App-Note-eMD-20x48-User-Guide.pdf?src-supplier=Avnet; ComponentLink1Description: https://www.invensense.com/wp-content/uploads/2016/06/App-Note-eMD-20x48-User-Guide.pdf?src-supplier=Avnet; ComponentLink2URL: https://www.invensense.com/wp-content/uploads/2016/06/App-Note-eMD-20x48-User-Guide.pdf?src-supplier=Avnet+Europe; ComponentLink2Description: https://www.invensense.com/wp-content/uploads/2016/06/App-Note-eMD-20x48-User-Guide.pdf?src-supplier=Avnet+Europe; ComponentLink3URL: https://www.invensense.com/wp-content/uploads/2016/06/App-Note-eMD-20x48-User-Guide.pdf?src-supplier=Digi-Key; ComponentLink3Description: https://www.invensense.com/wp-content/uploads/2016/06/App-Note-eMD-20x48-User-Guide.pdf?src-supplier=Digi-Key; ComponentLink4URL: http://www.farnell.com/datasheets/2632662.pdf?src-supplier=Farnell; ComponentLink4Description: http://www.farnell.com/datasheets/2632662.pdf?src-supplier=Farnell; ComponentLink5URL: http://www.farnell.com/datasheets/2632662.pdf?src-supplier=Element14; ComponentLink5Description: http://www.farnell.com/datasheets/2632662.pdf?src-supplier=Element14; ComponentLink6URL: http://www.farnell.com/datasheets/2632662.pdf?src-supplier=Newark; ComponentLink6Description: http://www.farnell.com/datasheets/2632662.pdf?src-supplier=Newark; ComponentLink7URL: https://www.invensense.com/wp-content/uploads/2016/06/App-Note-eMD-20x48-User-Guide.pdf?src-supplier=Component+Distributors+Inc.; ComponentLink7Description: https://www.invensense.com/wp-content/uploads/2016/06/App-Note-eMD-20x48-User-Guide.pdf?src-supplier=Component+Distributors+Inc.; Supplier Part Number 1: 2911498
VR1 = TLV1117-33CKVURG3: Single-Output LDO, 800mA, Fixed (3.3), Internal Current Limit, Thermal Overload Protection 3-TO-252 0 to 125; Manufacturer: Texas Instruments; Number of Outputs: 1; Min Input Voltage: 4.7V; Output Voltage: 3.3V; Max Input Voltage: 15V; Polarity: Positive; Quiescent Current: 10mA; Dropout Voltage: 1.2V; Input Bias Current: 5mA; Supplier 1: Farnell; Manufacturer Part Number: TLV1117-33CKVURG3; Stock 1: 0; Mount: Surface Mount; Case/Package: TO-252-3; Number of Pins: 3; Min Operating Temperature: -40°C; Max Operating Temperature: 125°C; Max Output Current: 800mA; Output Type: Fixed; Nominal Output Voltage: 3.3V; Output Current: 800mA; Packaging: Tape and Reel; Package Quantity: 1; Number of Regulators: 1; Min Current Limit: 800mA; Series: -; Radiation Hardening: No; REACH SVHC: No SVHC; Lead Free: Lead Free; RoHS Compliant: Yes; ComponentLink1URL: http://www.farnell.com/datasheets/1994335.pdf?src-supplier=Element14; ComponentLink1Description: http://www.farnell.com/datasheets/1994335.pdf?src-supplier=Element14; ComponentLink2URL: http://www.ti.com/lit/ds/symlink/tlv1117.pdf?src-supplier=Digi-Key; ComponentLink2Description: http://www.ti.com/lit/ds/symlink/tlv1117.pdf?src-supplier=Digi-Key; ComponentLink3URL: http://www.ti.com/general/docs/suppproductinfo.tsp?distId=10&amp;gotoUrl=http%3A%2F%2Fwww.ti.com%2Flit%2Fgpn%2Ftlv1117&src-supplier=Digi-Key; ComponentLink3Description: http://www.ti.com/general/docs/suppproductinfo.tsp?distId=10&amp;gotoUrl=http%3A%2F%2Fwww.ti.com%2Flit%2Fgpn%2Ftlv1117&src-supplier=Digi-Key; ComponentLink4URL: http://focus.ti.com/lit/ds/symlink/tlv1117-15.pdf?src-supplier=Avnet+Europe; ComponentLink4Description: http://focus.ti.com/lit/ds/symlink/tlv1117-15.pdf?src-supplier=Avnet+Europe; Supplier Part Number 1: 2463937RL
VR2 = MCP1804T-1802I/OT: MCP1804T-1802I/OT; LDOVoltage Regulator; 150mA; 1.8V +/-2%; 2 to 28Vin; 5-Pin SOT-23; Manufacturer: Microchip; Min Input Voltage: 2V; Max Input Voltage: 28V; Dropout Voltage: 2.2V; Number of Outputs: 1; Max Power Dissipation: 250mW; Polarity: Positive; Quiescent Current: 105uA; Accuracy: 2%; Output Type: Fixed; Supplier 1: Farnell; Manufacturer Part Number: MCP1804T-1802I/OT; Stock 1: 595; Pricing 1: 1=1.04, 25=0.795, 100=0.722 (EUR); Mount: Surface Mount; Case/Package: SOT-23; Number of Pins: 5; Min Operating Temperature: -40°C; Max Operating Temperature: 85°C; Max Output Current: 150mA; Output Voltage: 1.8V; Packaging: Tape and Reel; Output Current: 150mA; Nominal Output Voltage: 1.8V; Min Output Voltage: 1.8V; Length: 3.1mm; Width: 1.8mm; Height: 1.3mm; REACH SVHC: No SVHC; Lead Free: Lead Free; RoHS Compliant: Yes; ComponentLink1URL: http://www.microchip.com/mymicrochip/filehandler.aspx?ddocname=en544680&src-supplier=Future+Electronics; ComponentLink1Description: http://www.microchip.com/mymicrochip/filehandler.aspx?ddocname=en544680&src-supplier=Future+Electronics; ComponentLink2URL: http://www.microchip.com/mymicrochip/filehandler.aspx?ddocname=en533805&src-supplier=Digi-Key; ComponentLink2Description: http://www.microchip.com/mymicrochip/filehandler.aspx?ddocname=en533805&src-supplier=Digi-Key; Supplier Part Number 1: 1825003